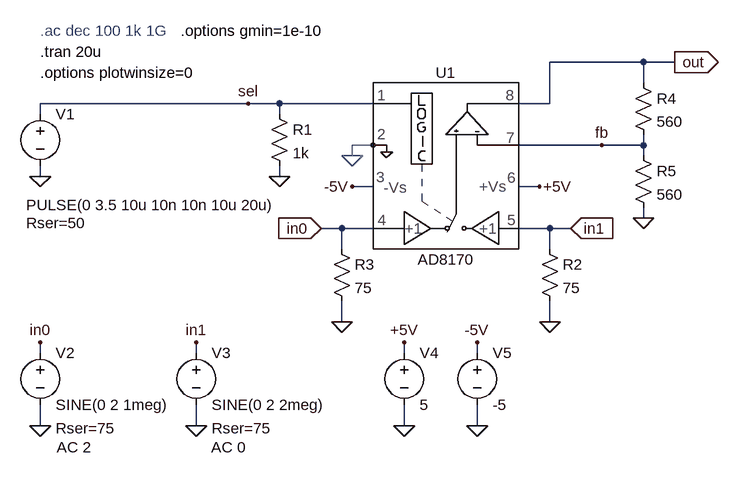
[diagram p0: schematic AD8170_test.asc]
AD8170_test.asc, the LTspice schematic file:
Version 4
SHEET 1 880 680
WIRE 592 16 448 16
WIRE 640 16 592 16
WIRE 592 48 592 16
WIRE -16 80 -336 80
WIRE 32 80 -16 80
WIRE 176 80 32 80
WIRE 448 80 448 16
WIRE 448 80 400 80
WIRE -336 96 -336 80
WIRE 32 96 32 80
WIRE 528 144 400 144
WIRE 592 144 592 128
WIRE 592 144 528 144
WIRE 592 160 592 144
WIRE -336 192 -336 176
WIRE 32 192 32 176
WIRE 176 208 144 208
WIRE 432 208 400 208
WIRE 592 256 592 240
WIRE 128 272 96 272
WIRE 176 272 128 272
WIRE 448 272 400 272
WIRE 480 272 448 272
WIRE 128 304 128 272
WIRE 448 304 448 272
WIRE 128 416 128 384
WIRE 448 416 448 384
WIRE -336 464 -336 448
WIRE -96 464 -96 448
WIRE 224 464 224 448
WIRE 336 464 336 448
WIRE -336 576 -336 544
WIRE -96 576 -96 544
WIRE 224 576 224 544
WIRE 336 576 336 544
FLAG 128 416 0
FLAG 448 416 0
FLAG 592 256 0
FLAG 96 272 in0
IOPIN 96 272 In
FLAG 480 272 in1
IOPIN 480 272 In
FLAG 432 208 +5V
FLAG 144 208 -5V
FLAG -96 576 0
FLAG -336 576 0
FLAG -336 448 in0
FLAG -96 448 in1
FLAG -336 192 0
FLAG 32 192 0
FLAG 224 576 0
FLAG 224 448 +5V
FLAG 336 576 0
FLAG 336 448 -5V
FLAG 640 16 out
IOPIN 640 16 Out
FLAG -16 80 sel
FLAG 528 144 fb
SYMBOL ad8170 288 176 R0
SYMATTR InstName U1
SYMBOL res 16 80 R0
SYMATTR InstName R1
SYMATTR Value 1k
SYMBOL res 432 288 R0
SYMATTR InstName R2
SYMATTR Value 75
SYMBOL res 112 288 R0
SYMATTR InstName R3
SYMATTR Value 75
SYMBOL res 576 32 R0
SYMATTR InstName R4
SYMATTR Value 560
SYMBOL res 576 144 R0
SYMATTR InstName R5
SYMATTR Value 560
SYMBOL voltage -336 80 R0
WINDOW 3 -22 156 Left 0
WINDOW 123 0 0 Left 0
WINDOW 39 -22 184 Left 0
SYMATTR Value PULSE(0 3.5 10u 10n 10n 10u 20u)
SYMATTR SpiceLine Rser=50
SYMATTR InstName V1
SYMBOL voltage -336 448 R0
WINDOW 123 25 161 Left 0
WINDOW 39 24 132 Left 0
SYMATTR Value2 AC 2
SYMATTR SpiceLine Rser=75
SYMATTR InstName V2
SYMATTR Value SINE(0 2 1meg)
SYMBOL voltage -96 448 R0
WINDOW 123 23 161 Left 0
WINDOW 39 24 132 Left 0
SYMATTR Value2 AC 0
SYMATTR SpiceLine Rser=75
SYMATTR InstName V3
SYMATTR Value SINE(0 2 2meg)
SYMBOL voltage 224 448 R0
SYMATTR InstName V4
SYMATTR Value 5
SYMBOL voltage 336 448 R0
SYMATTR InstName V5
SYMATTR Value -5
TEXT -336 0 Left 0 !.tran 20u
TEXT -336 32 Left 0 !.options plotwinsize=0
TEXT -336 -32 Left 0 ;.ac dec 100 1k 1G
TEXT -120 -32 Left 0 !.options gmin=1e-10
LINE Normal 144 144 176 144
LINE Normal 144 160 144 144
LINE Normal 160 160 144 160
LINE Normal 144 176 160 160
LINE Normal 128 160 144 176
LINE Normal 144 160 128 160

The netlist it stands for:
* AD8170_test.asc
XU1 sel in0 in1 fb +5V -5V out AD8170  ; pins 1 4 5 7 6 3 8
R1 sel 0 1k
R2 in1 0 75
R3 in0 0 75
R4 out fb 560
R5 fb 0 560
V1 sel 0 PULSE(0 3.5 10u 10n 10n 10u 20u) Rser=50
V2 in0 0 SINE(0 2 1meg) AC 2 Rser=75
V3 in1 0 SINE(0 2 2meg) AC 0 Rser=75
V4 +5V 0 5
V5 -5V 0 -5
.tran 20u
.options plotwinsize=0
* .ac dec 100 1k 1G
.options gmin=1e-10
.lib ad8170_.cir
.backanno
.end